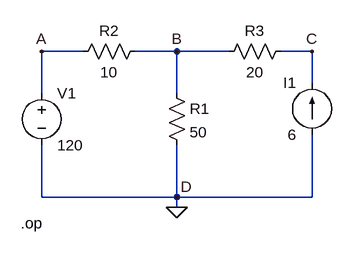
[diagram p0: schematic simple_mesh_ckt.asc]
simple_mesh_ckt.asc, the LTspice schematic file:
Version 4
SHEET 1 880 680
WIRE 80 64 16 64
WIRE 224 64 160 64
WIRE 304 64 224 64
WIRE 432 64 384 64
WIRE 432 112 432 64
WIRE 16 128 16 64
WIRE 224 128 224 64
WIRE 16 288 16 208
WIRE 224 288 224 208
WIRE 224 288 16 288
WIRE 432 288 432 192
WIRE 432 288 224 288
WIRE 224 304 224 288
FLAG 224 304 0
FLAG 16 64 A
FLAG 224 64 B
FLAG 432 64 C
FLAG 224 288 D
SYMBOL voltage 16 112 R0
SYMATTR InstName V1
SYMATTR Value 120
SYMBOL res 208 112 R0
SYMATTR InstName R1
SYMATTR Value 50
SYMBOL res 176 48 R90
WINDOW 0 0 56 VBottom 2
WINDOW 3 32 56 VTop 2
SYMATTR InstName R2
SYMATTR Value 10
SYMBOL res 400 48 R90
WINDOW 0 0 56 VBottom 2
WINDOW 3 32 56 VTop 2
SYMATTR InstName R3
SYMATTR Value 20
SYMBOL current 432 192 R180
WINDOW 0 24 80 Left 2
WINDOW 3 24 0 Left 2
SYMATTR InstName I1
SYMATTR Value 6
TEXT -16 328 Left 2 !.op

The netlist it stands for:
* simple_mesh_ckt.asc
V1 A 0 120
R1 B 0 50
R2 B A 10
R3 C B 20
I1 0 C 6
.op
.backanno
.end